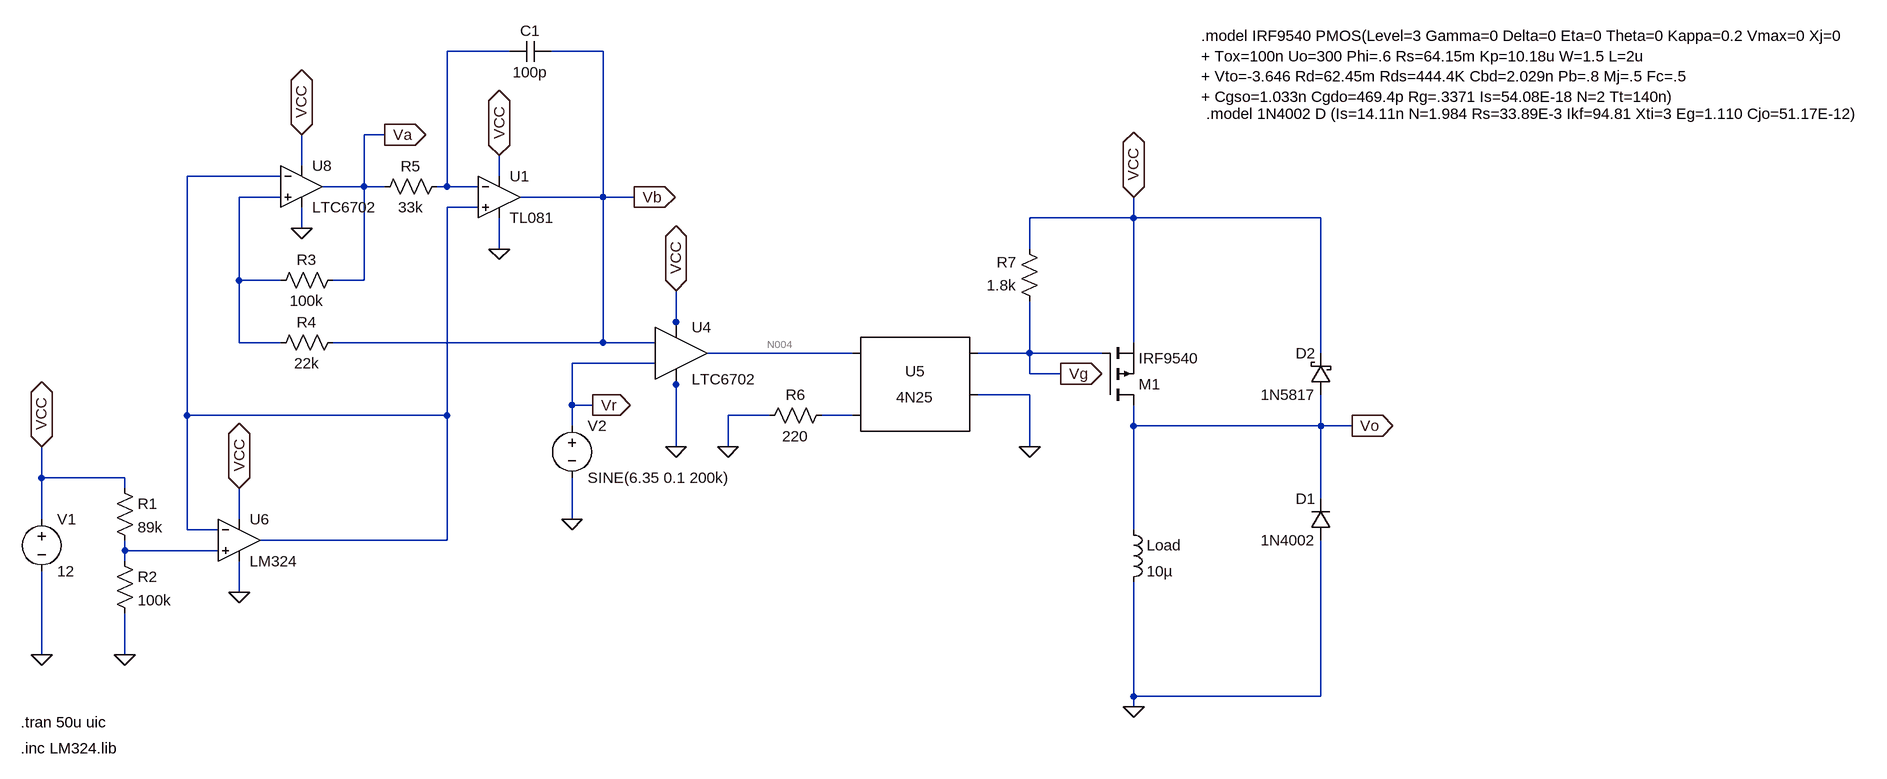
[diagram p0: schematic Ejemplo de modulador triangular en LTSPICE.asc]
* Ejemplo de modulador triangular en LTSPICE.asc
R5 N001 Va 33k
R1 VCC N006 89k
R2 N006 0 100k
V1 VCC 0 12
R3 Va N003 100k
R4 Vb N003 22k
D1 0 Vo 1N4002
V2 Vr 0 SINE(6.35 0.1 200k)
C1 Vb N001 100p
M1 Vo Vg VCC VCC IRF9540
Load Vo 0 10µ Rser=1
D2 Vo VCC 1N5817
XU4 Vr Vb VCC 0 N004 LTC6702
XU5 N004 N005 Vg 0 NC_01 4N25
R6 N005 0 220
R7 Vg VCC 1.8k
XU6 N006 N002 VCC 0 N002 LM324  ; pins In+ In- V+ V- OUT
XU8 N003 N002 VCC 0 Va LTC6702  ; pins In+ In- V+ V- OUT
* U1: TL081 (symbol TL081 not available, pins judged from their places): In+=N002 In-=N001 V+=VCC V-=0 OUT=Vb
.model D D
.lib standard.dio
.model NMOS NMOS
.model PMOS PMOS
.lib standard.mos
.tran 50u uic
.model IRF9540 PMOS(Level=3 Gamma=0 Delta=0 Eta=0 Theta=0 Kappa=0.2 Vmax=0 Xj=0
+ Tox=100n Uo=300 Phi=.6 Rs=64.15m Kp=10.18u W=1.5 L=2u
+ Vto=-3.646 Rd=62.45m Rds=444.4K Cbd=2.029n Pb=.8 Mj=.5 Fc=.5
+ Cgso=1.033n Cgdo=469.4p Rg=.3371 Is=54.08E-18 N=2 Tt=140n)
.model 1N4002 D (Is=14.11n N=1.984 Rs=33.89E-3 Ikf=94.81 Xti=3 Eg=1.110 Cjo=51.17E-12)
.inc LM324.lib
.lib LTC3.lib
.lib 4N25.sub
.backanno
.end

* Results of the author's LTspice run, read from the files saved beside the schematic
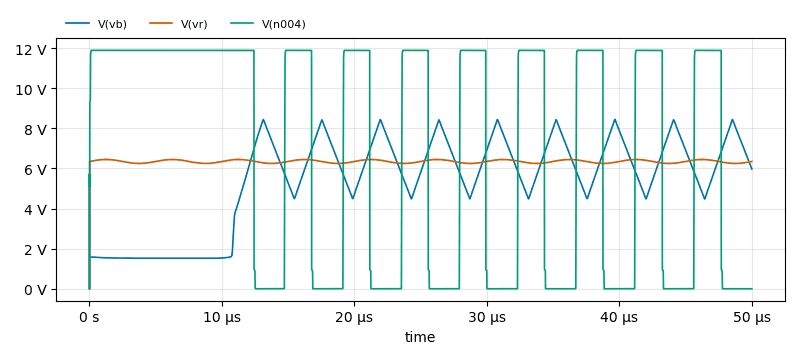
[diagram p1: Transient Analysis of Ejemplo de modulador triangular en LTSPICE.asc, plotted from the saved traces]
* Transient Analysis, 1 run:
*   V(vb): min 0 V, max 8.449 V, average 5.394 V, rms 5.858 V, last 5.972 V
*   V(vr): min 0 V, max 6.45 V, average 6.35 V, rms 6.351 V, last 6.35 V
*   V(n004): min -1.612 mV, max 11.89 V, average 6.798 V, rms 8.97 V, last 0 V